# EAGLE design cradle_venus (EAGLE 9.6.2)
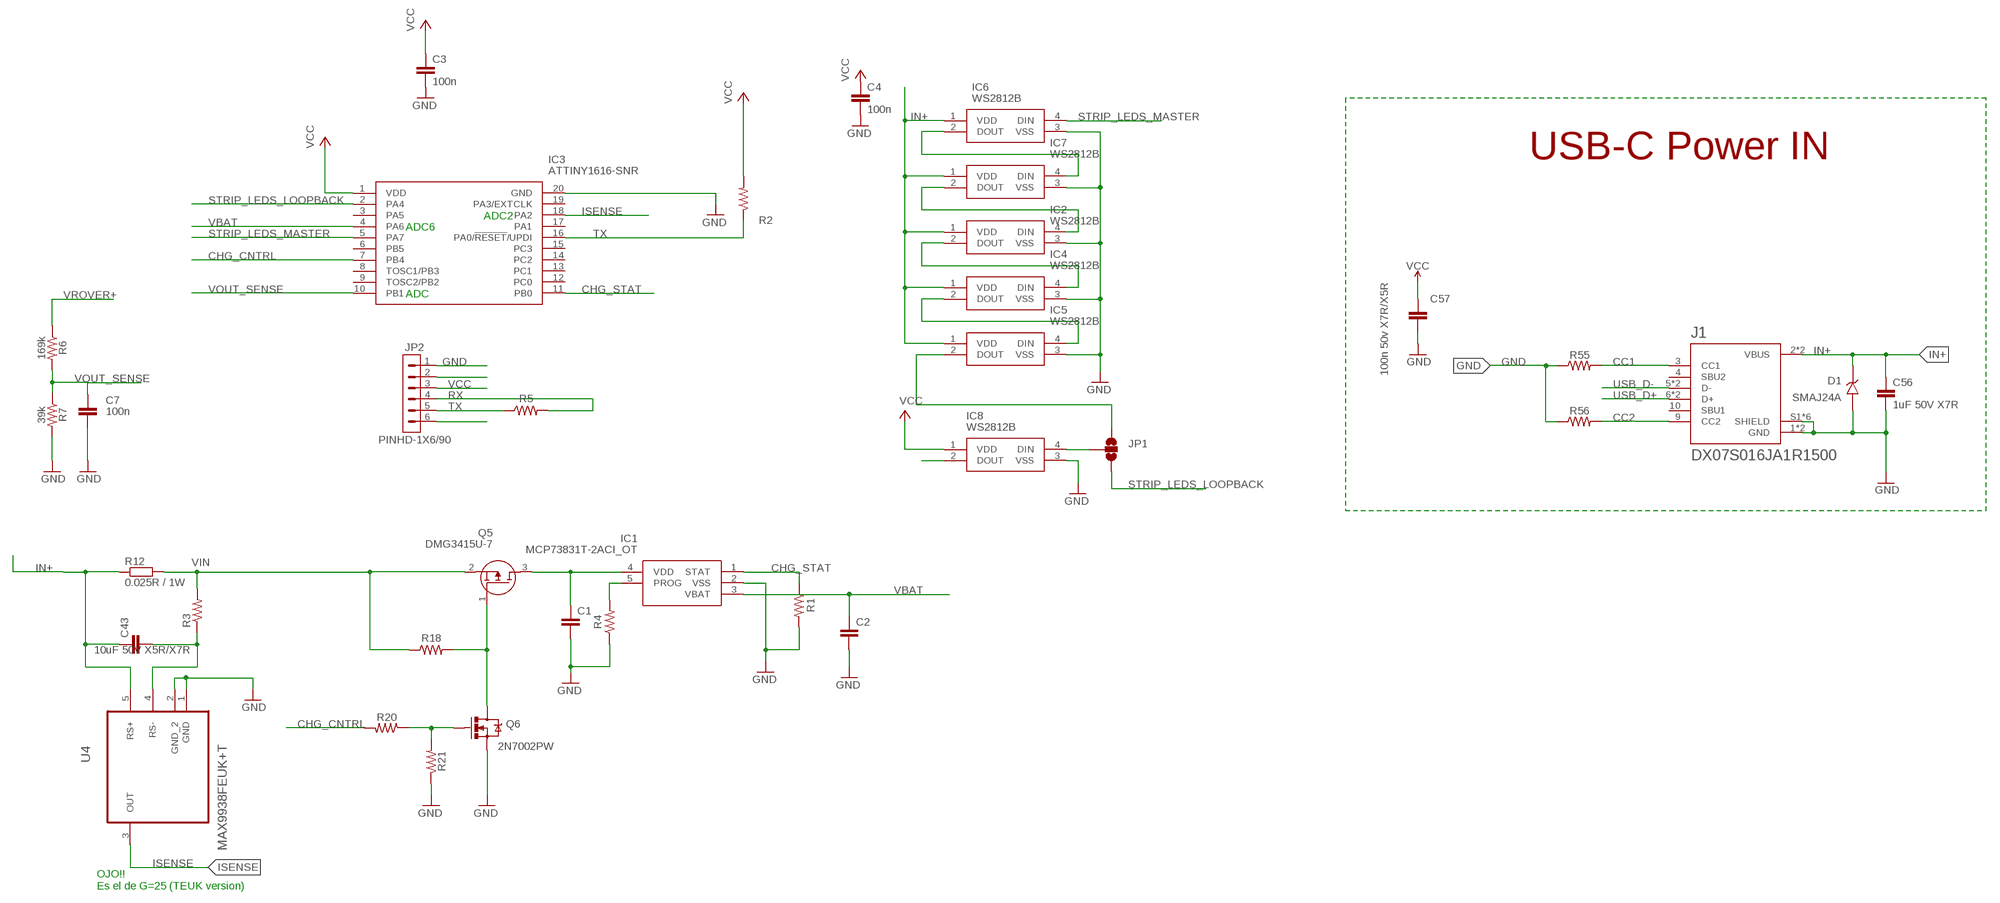
[diagram p0: schematic, sheet 1]

## Parts
C1  C-EUC0805  [C0805]
C2  C-EUC0805  [C0805]
C3  100n  C-EUC0805  [C0805]
C4  100n  C-EUC0805  [C0805]
C7  100n  0.1UF-0603-25V-(+80/-20%)  [0603]
C43  10uF 50V X5R/X7R  CAP1206  [1206]
C56  1uF 50V X7R  CAP0805  [0805]
C57  100n 50v X7R/X5R  CAP0805  [0805]
D1  SMAJ24A  3SMAJ5934B  [DIOM4325X244N]
IC1  MCP73831T-2ACI_OT  [SOT95P270X145-5N]
IC2  WS2812B  [WS2812B]
IC3  ATTINY1616-SNR  [SOIC127P1030X265-20N]
IC4  WS2812B  [WS2812B]
IC5  WS2812B  [WS2812B]
IC6  WS2812B  [WS2812B]
IC7  WS2812B  [WS2812B]
IC8  WS2812B  [WS2812B]
J1  DX07S016JA1R1500  [JAE_DX07S016JA1R1500]
JP1  JUMPER-SMT_3_NO_SILK  [SMT-JUMPER_3_NO_SILK]
JP2  PINHD-1X6/90  [1X06/90]
Q5  DMG3415U-7  SSM3J338R,LF  [SSM3J332RLFT]
Q6  2N7002PW  MOSFET-NCHANNEL2N7002PW  [SOT323]
R1  RESISTOR0805  [0805]
R2  RESISTOR0805  [0805]
R3  RESISTOR0805  [0805]
R4  RESISTOR0805  [0805]
R5  RESISTOR0805  [0805]
R6  169k  RESISTOR0603  [0603]
R7  39k  RESISTOR0603  [0603]
R12  0.025R / 1W  RR2512  [R2512]
R18  RESISTOR0805  [0805]
R20  RESISTOR0805  [0805]
R21  RESISTOR0805  [0805]
R55  RESISTOR0805  [0805]
R56  RESISTOR0805  [0805]
U4  MAX9938FEUK+T  [SOT95P280X145-5N]

## Nets
CC1: J1.3(CC1) R55.2
CC2: J1.9(CC2) R56.2
CHG_CNTRL: IC3.7(PB4) R20.2
CHG_STAT: IC1.1(STAT) IC3.11(PB0) R1.1
GND: C1.2 C2.2 C3.2 C4.2 C7.2 C56.2 C57.2 D1.A IC1.2(VSS) IC2.3(VSS) IC3.20(GND) IC4.3(VSS) IC5.3(VSS) IC6.3(VSS) IC7.3(VSS) IC8.3(VSS) J1.1(GND) J1.12(GND) J1.S1(SHIELD) J1.S2(SHIELD) J1.S3(SHIELD) J1.S4(SHIELD) J1.S5(SHIELD) J1.S6(SHIELD) JP2.1 Q6.2(S) R1.2 R4.1 R7.2 R21.1 R55.1 R56.1 U4.1(GND) U4.2(GND_2)
IN+: C3.1 C4.1 C43.1 C56.1 C57.1 D1.C(K) IC2.1(VDD) IC3.1(VDD) IC4.1(VDD) IC5.1(VDD) IC6.1(VDD) IC7.1(VDD) IC8.1(VDD) J1.2(VBUS) J1.11(VBUS) R2.2 R12.1 U4.5(RS+) ; supply symbol labelled VCC
ISENSE: IC3.18(PA2) U4.3(OUT)
N$1: C1.1 IC1.4(VDD) Q5.3(D)
N$2: IC6.2(DOUT) IC7.4(DIN)
N$4: C43.2 R3.1 U4.4(RS-)
N$5: IC2.2(DOUT) IC4.4(DIN)
N$6: IC4.2(DOUT) IC5.4(DIN)
N$7: Q6.1(G) R20.1 R21.2
N$8: IC2.4(DIN) IC7.2(DOUT)
N$9: IC8.4(DIN) JP1.2
N$10: IC5.2(DOUT) JP1.1
N$11: IC8.2(DOUT)
N$12: Q5.1(G) Q6.3(D) R18.2
N$13: JP2.2
N$14: JP2.6
N$15: IC1.5(PROG) R4.2
RX: JP2.4 R5.2
STRIP_LEDS_LOOPBACK: IC3.2(PA4) JP1.3
STRIP_LEDS_MASTER: IC3.5(PA7) IC6.4(DIN)
TX: IC3.16(PA0/!RESET!/UPDI) JP2.5 R2.1 R5.1
USB_D+: J1.6(D+) J1.7(D+)
USB_D-: J1.5(D-) J1.8(D-)
VBAT: C2.1 IC1.3(VBAT) IC3.4(PA6)
VCC: JP2.3
VIN: Q5.2(S) R3.2 R12.2 R18.1
VOUT_SENSE: C7.1 IC3.10(PB1) R6.2 R7.1
VROVER+: R6.1
Unconnected: IC3.3(PA5) IC3.6(PB5) IC3.8(TOSC1/PB3) IC3.9(TOSC2/PB2) IC3.12(PC0) IC3.13(PC1) IC3.14(PC2) IC3.15(PC3) IC3.17(PA1) IC3.19(PA3/EXTCLK) J1.4(SBU2) J1.10(SBU1)

## Notes on the sheet
- USB-C Power IN
- ADC2
- ADC6
- ADC
- OJO!!
  Es el de G=25 (TEUK version)

## Library data of the parts
C1-C4 = resistor:C-EU: CAPACITOR, European symbol
C7 = SparkFun-Capacitors:0.1UF: 0.1µF ceramic capacitors A capacitor is a passive two-terminal electrical component used to store electrical energy temporarily in an electric field.; PROD_ID: CAP-00810; VALUE: 0.1uF
C43 C56 C57 = SparkFun-Passives:CAP: Capacitor Standard 0603 ceramic capacitor, and 0.1" leaded capacitor.
D1 = 3SMAJ5934B:3SMAJ5934B: Check availability <https://pricing.snapeda.com/parts/3SMAJ5934B/Micro%20Commercial%20Components/view-part?ref=eda>; AVAILABILITY: Not in stock; DESCRIPTION: Zener Diode Single 24V 5% 19Ohm 3000mW 2-Pin SMA T/R; MF: Micro Commercial Components; MP: 3SMAJ5934B; PACKAGE: None; PRICE: None
IC1 = SamacSys_Parts:MCP73831T-2ACI_OT: Li-Ion Charge Controller 4.2V SOT23-5 Source: Datasheet <http://ww1.microchip.com/downloads/en/DeviceDoc/20001984g.pdf>; ARROW_PART_NUMBER: MCP73831T-2ACI/OT; ARROW_PRICE-STOCK: https://www.arrow.com/en/products/mcp73831t-2aciot/microchip-technology?utm_currency=USD&region=europe; DESCRIPTION: Li-Ion Charge Controller 4.2V SOT23-5; HEIGHT: 1.45mm; MANUFACTURER_NAME: Microchip; MANUFACTURER_PART_NUMBER: MCP73831T-2ACI/OT; MOUSER_PART_NUMBER: 579-MCP73831T-2ACIOT; MOUSER_PRICE-STOCK: https://www.mouser.co.uk/ProductDetail/Microchip-Technology/MCP73831T-2ACI-OT?qs=yUQqVecv4qvbBQBGbHx0Mw%3D%3D
IC2 IC4-IC8 = SamacSys_Parts:WS2812B: NeoPixel 5050 RGB LED with Integrated Driver Chip - 10 Pack Source: Datasheet <https://cdn-shop.adafruit.com/datasheets/WS2812B.pdf>; DESCRIPTION: NeoPixel 5050 RGB LED with Integrated Driver Chip - 10 Pack; HEIGHT: 1.62mm; MANUFACTURER_NAME: Adafruit; MANUFACTURER_PART_NUMBER: WS2812B
IC3 = SamacSys_Parts:ATTINY1616-SNR: 8-bit Microcontrollers - MCU 20MHZ SOIC 85C GRN Source: Datasheet <https://datasheet.datasheetarchive.com/originals/distributors/DKDS41/DSANUWW0026757.pdf>; ARROW_PART_NUMBER: ATTINY1616-SNR; ARROW_PRICE-STOCK: https://www.arrow.com/en/products/attiny1616-snr/microchip-technology?utm_currency=USD&region=nac; DESCRIPTION: 8-bit Microcontrollers - MCU 20MHZ SOIC 85C GRN; HEIGHT: 2.65mm; MANUFACTURER_NAME: Microchip; MANUFACTURER_PART_NUMBER: ATTINY1616-SNR; MOUSER_PART_NUMBER: 556-ATTINY1616SNR; MOUSER_PRICE-STOCK: https://www.mouser.co.uk/ProductDetail/Microchip-Technology/ATTINY1616-SNR?qs=HXFqYaX1Q2w711d4DTfCdw%3D%3D
J1 = DX07S016JA1R1500:DX07S016JA1R1500: USB-C (USB TYPE-C) USB 2.0 Receptacle Connector 24 (16+8 Dummy) Position Surface Mount, Right Angle; Through Hole; DESCRIPTION: USB-C (USB TYPE-C) USB 2.0 Receptacle Connector 24 (16+8 Dummy) Position Surface Mount, Right Angle; Through Hole; DIGI-KEY_PART_NUMBER: 670-DX07S016JA1R1500CT-ND; MF: JAE Electronics; MP: DX07S016JA1R1500; PACKAGE: None; PURCHASE-URL: https://pricing.snapeda.com/search/part/DX07S016JA1R1500/?ref=eda
JP1 = SparkFun-Jumpers:JUMPER-SMT_3_NO: Normally open jumper This jumper has three pads in close proximity to each other. Apply solder to close the connection(s).
JP2 = Connector:PINHD-1X6: Pin Header; CATEGORY: Connectors; DESCRIPTION: Header-Right Angle-6 Position; PACKAGE_TYPE: Through Hole; PITCH: 0.100" (2.54mm); SUBCATEGORY: Headers; TYPE: Male Pins
Q5 = SSM3J338R_LF:SSM3J338R,LF: MOSFET Small-signal MOSFET Vdss= -12V, ID= -6A Source: Datasheet <http://toshiba.semicon-storage.com/info/docget.jsp?did=30384&prodName=SSM3J338R>; ARROW_PART_NUMBER: SSM3J338R,LF; ARROW_PRICE-STOCK: https://www.arrow.com/en/products/ssm3j338rlf/toshiba?region=nac; DESCRIPTION: MOSFET Small-signal MOSFET Vdss= -12V, ID= -6A; HEIGHT: mm; MANUFACTURER_NAME: Toshiba; MANUFACTURER_PART_NUMBER: SSM3J338R,LF; MOUSER_PART_NUMBER: 757-SSM3J338RLF; MOUSER_PRICE-STOCK: https://www.mouser.co.uk/ProductDetail/Toshiba/SSM3J338RLF?qs=lhkzy8lC%252BSvURFM9ZjmJSw%3D%3D
Q6 = SparkFun-DiscreteSemi:MOSFET-NCHANNEL: Common NMOSFET Parts MFG P/N Store ID Prod ID FDD8780 TRANS-09984 SI7820DN TRANS-11055 FDS6630A IC-08089 2N7002PW TRANS-11151 FQP30N06L COM-10213 TRANS-10060 BSS123LT1G TRANS-08345 BSS138 TRANS-00830 BS170 2N7000; PROD_ID: TRANS-11151
R1-R7 R18 R20 R21 R55 R56 = SparkFun-Resistors:RESISTOR: Generic Resistor Package
R12 = eagle-ltspice:R: RESISTOR, European symbol; SPICEMODEL: NONE; SPICEPREFIX: R
U4 = MAX9938:MAX9938FEUK+T; DESCRIPTION: Precision Current-Sense Amplifier; MPN: MAX9938FEUK+T; OC_FARNELL: -; OC_NEWARK: 01N6733; PACKAGE: SOT-23-5; SUPPLIER: Maxim

## Net classes
1 highpower: width 0.254 mm, drill 0.483 mm

## Board
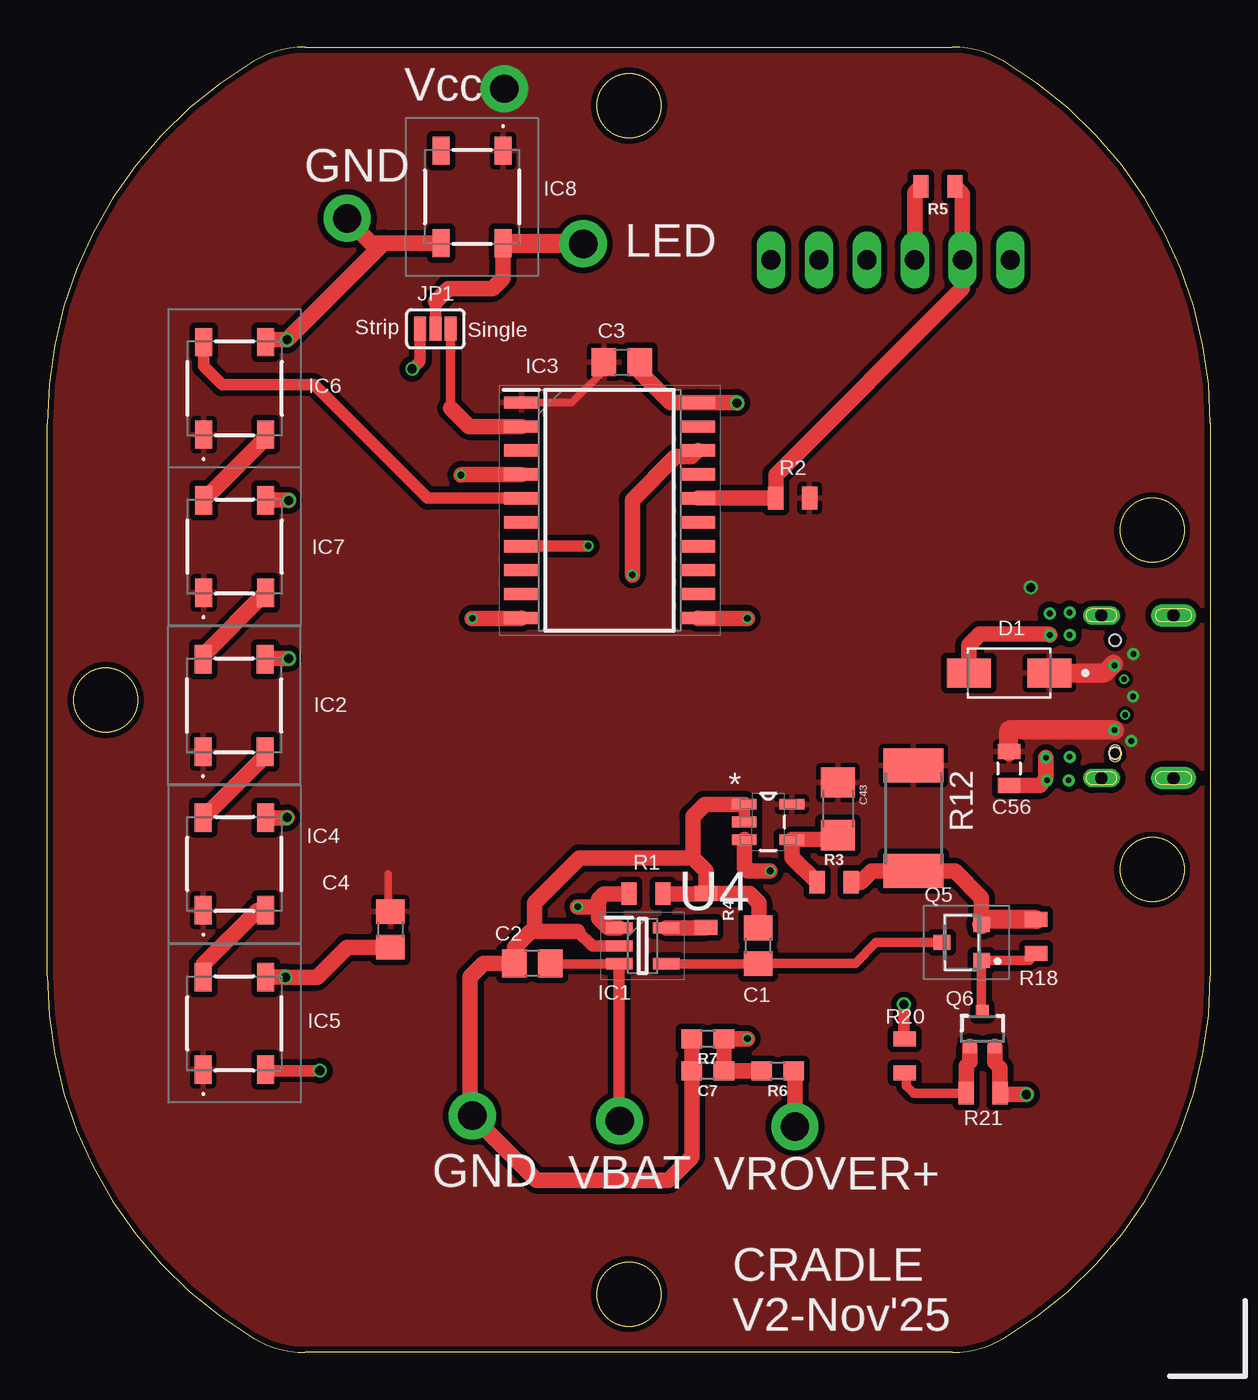
[diagram p1: board, top side]
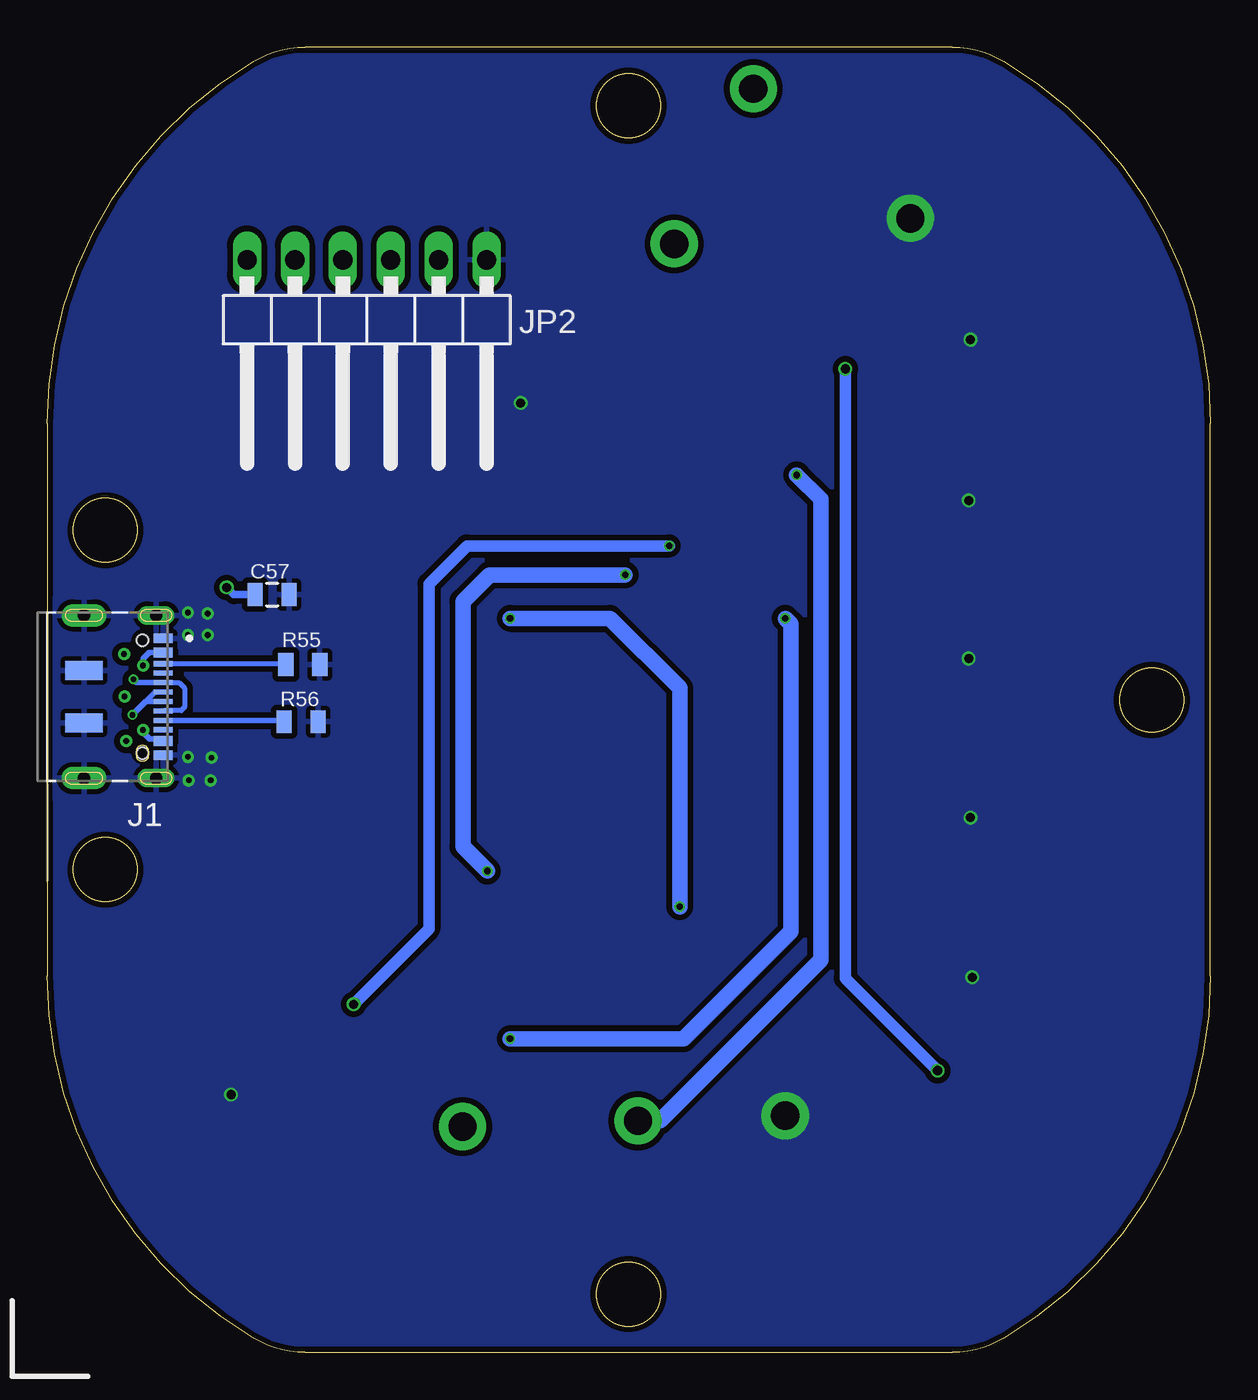
[diagram p2: board, bottom side, seen from below]

Size 61.7 x 69.23 mm. Coordinates in mm from the lower left corner, seen from the top.
Outline: 10.96,0.75 arc31 13.69,0 48.01,0 arc31 50.74,0.75 arc59 61.7,19.98 61.7,49.25 arc59 50.74,68.48 arc31 48.01,69.23 13.69,69.23 arc31 10.96,68.48 arc59 0,49.25 0,19.98 arc59 10.96,0.75
Outline: circle at 30.86,66.12 radius 1.7
Outline: circle at 58.61,43.6 radius 1.7
Outline: circle at 30.86,3.09 radius 1.7
Outline: circle at 3.11,34.6 radius 1.7
Outline: circle at 58.61,25.6 radius 1.7
Copper layers (1*16): Top 0.035mm / dielectric 1.5mm / Bottom 0.035mm
Design rules "default *": minimum track width 8mil, minimum drill 12mil, track to track 8mil, track to pad 8mil, pad to pad 8mil, via to via 8mil, smd to smd 0mil, copper to edge 10mil, drill to drill 8mil, minimum pad ring 6mil, minimum via ring 4mil, stop-mask expansion 4mil, vias tented up to drill 0mil, thermal gap 10mil

### Footprints (pad centres in the part's own frame; a part is rotated, then mirrored left to right if it is on the bottom)
C0805 = smd 1.3 x 1.5: 1 -0.95,0; 2 0.95,0
0603 = smd 1.1 x 1: 1 -0.85,0; 2 0.85,0
1206 = smd 1.6 x 1.8: 1 -1.4,0; 2 1.4,0
0805 = smd 0.8 x 1.2: 1 -0.9,0; 2 0.9,0
DIOM4325X244N = smd 2.33 x 1.55: A 2.135,0; C -2.135,0
SOT95P270X145-5N = smd 1.4 x 0.6: 1 -1.25,0.95; 2 -1.25,0; 3 -1.25,-0.95; 4 1.25,-0.95; 5 1.25,0.95
WS2812B = smd 1.5 x 0.9: 1 -2.45,1.65; 2 -2.45,-1.65; 3 2.45,-1.65; 4 2.45,1.65
SOIC127P1030X265-20N = smd 1.85 x 0.65: 1 -4.675,5.715; 2 -4.675,4.445; 3 -4.675,3.175; 4 -4.675,1.905; 5 -4.675,0.635; 6 -4.675,-0.635; 7 -4.675,-1.905; 8 -4.675,-3.175; 9 -4.675,-4.445; 10 -4.675,-5.715; 11 4.675,-5.715; 12 4.675,-4.445; 13 4.675,-3.175; 14 4.675,-1.905; 15 4.675,-0.635; 16 4.675,0.635; 17 4.675,1.905; 18 4.675,3.175; 19 4.675,4.445; 20 4.675,5.715
JAE_DX07S016JA1R1500 = smd 0.52 x 1: 1 -3.1,1.1; 2 -2.35,1.1; 11 2.35,1.1; 12 3.1,1.1 | smd 0.27 x 1: 3 -1.75,1.1; 4 -1.25,1.1; 5 -0.75,1.1; 6 -0.25,1.1; 7 0.25,1.1; 8 0.75,1.1; 9 1.25,1.1; 10 1.75,1.1 | smd 1 x 2: S1 -1.4,-3.1; S2 1.4,-3.1 | drill 0.65 long: S3 -4.32,0.725; S4 4.32,0.725 | drill 0.65 pad 1.2 long: S5 -4.32,-3.1; S6 4.32,-3.1 | hole 0.6: 3,0 | hole 0.63: 3,0; -3,0
SMT-JUMPER_3_NO_SILK = smd 0.635 x 1.27: 1 -0.813,0; 2 0,0; 3 0.813,0
1X06/90 = drill 1.016 long: 1 -6.35,-3.81; 2 -3.81,-3.81; 3 -1.27,-3.81; 4 1.27,-3.81; 5 3.81,-3.81; 6 6.35,-3.81
SSM3J332RLFT = smd 0.8 x 0.9: 1 -0.95,-1.05; 2 0.95,-1.05; 3 0,1.05
SOT323 = smd 0.7 x 0.7: 1 -0.65,-0.925; 2 0.65,-0.925; 3 0,0.925
R2512 = smd 1.8 x 3.2: 1 -2.8,0; 2 2.8,0
SOT95P280X145-5N = smd 1.321 x 0.559: 1 -1.27,0.94; 2 -1.27,0; 3 -1.27,-0.94; 4 1.27,-0.94; 5 1.27,0.94

### Placement (x,y rotation side)
C1  37.71,21.56 90 top
C2  25.73,20.63 180 top
C3  30.47,52.52 0 top
C4  18.2,22.43 270 top
C7  35.05,14.93 180 top
C43  41.94,28.83 270 top
C56  51.02,30.96 270 top
C57  49.77,40.19 0 bottom
D1  51.02,36.03 180 top
IC1  31.58,21.56 0 top
IC2  9.91,34.31 90 top
IC3  29.83,44.66 0 top
IC4  9.94,25.9 90 top
IC5  9.94,17.45 90 top
IC6  9.94,51.13 90 top
IC7  9.94,42.74 90 top
IC8  22.53,61.28 270 top
J1  56.64,34.77 270 bottom
JP1  20.59,54.29 0 top
JP2  44.74,54.13 180 bottom
Q5  48.52,21.74 90 top
Q6  49.6,17.15 0 top
R1  31.75,24.32 0 top
R2  39.55,45.31 0 top
R3  41.74,24.93 0 top
R4  34.94,23.43 270 top
R5  47.24,61.83 180 top
R6  38.74,14.93 180 top
R7  35.05,16.63 180 top
R12  45.94,28.33 270 top
R18  52.45,22.05 270 top
R20  45.47,15.73 90 top
R21  49.64,13.74 180 top
R55  48.13,36.48 180 bottom
R56  48.23,33.45 180 bottom
U4  38.24,28.13 0 top

### Tracks (layer width: path | path; a pad name or v marks a point on that pad's centre or on a via)
CC1
  Bottom 0.254: J1.3 49.08,36.52
  Bottom 0.305: 49.08,36.52 R55.2
CC2
  Bottom 0.305: J1.9 49.2,33.52 R56.2
CHG_CNTRL  (via drill 0.35, 0.48)
  Top 0.61: v28.69,42.77 28.68,42.76 IC3.7 | v45.44,18.46 45.44,16.66 R20.2
  Bottom 0.61: v45.44,18.46 41.44,22.46 41.44,40.76 39.44,42.77 v28.69,42.77
CHG_STAT  (via drill 0.35)
  Top 0.813: IC1.1 29.77,22.51 29.24,23.03 29.24,23.53 | 29.24,23.53 29.24,24.03 29.53,24.32 R1.1 | 29.24,23.53 29.14,23.63 v28.14,23.63 | v37.14,38.93 34.52,38.93 IC3.11
  Bottom 0.813: v37.14,38.93 31.84,38.93 28.14,35.23 v28.14,23.63
GND  (via drill 0.3 pad 0.64, 0.48, 1.5 pad 2.5)
  Top 0.61: IC1.2 28.91,21.56 28.14,22.33 | U4.2 U4.1
  Top 0.813: D1.A 48.88,37.51 49.46,38.09 53.13,38.09 v53.18,38.04 | C56.2 52.64,30.06 52.98,30.4 v52.98,31.54 | Q6.2 50.25,15.38 50.55,15.09 R21.1 50.61,13.67 v51.94,13.67 | v36.58,50.35 36.56,50.38 IC3.20 33.07,50.38 31.42,52.02 C3.2 | IC6.3 11.72,53.71 v12.72,53.71 17.84,58.83 IC8.3 17.19,58.83 15.91,60.11 v15.91,60.15 | IC7.3 v12.8,45.19 v12.81,45.18 | IC2.3 11.6,36.8 v12.81,36.8 | IC4.3 v12.71,28.35 v12.72,28.36 | IC5.3 v12.62,19.9 v12.63,19.89 14.31,19.89 15.91,21.48 C4.2 | 28.14,22.33 25.84,22.33 | 25.84,22.33 25.64,22.33 24.78,21.47 C2.2 23.14,20.63 22.42,19.91 22.42,12.68 v22.55,12.55 25.97,9.13 32.94,9.13 34.19,10.38 C7.2 R7.2 | R1.2 R4.1 | R4.1 37.24,24.33 37.74,23.83 37.74,22.54 C1.2 | 25.84,22.33 25.84,23.83 28.24,26.23 34.24,26.23 | R4.1 34.94,25.53 34.24,26.23 | U4.1 34.88,29.07 34.24,28.43 34.24,26.23
  other vias: 54.23,31.59 54.18,30.34 53.03,30.34 54.23,39.24 54.23,38.04 53.18,39.19
  pour Bottom (isolate 0.254): 52.64,37.38 52.64,39.98 61.61,39.98 61.61,29.38 61.58,29.35 52.74,29.35 52.66,29.43 52.66,32.18 54.96,32.18 54.96,31.63 59.06,31.63 59.06,37.48 58.71,37.83 56.52,37.83 56.06,37.38
  pour Bottom (isolate 0.305): -0.86,-1.27 63.45,-1.27 63.45,70.73 -0.86,70.73
IN+  (via drill 0.3 pad 0.64, 0.48, 1.5 pad 2.5)
  Top 0.406: C3.1 29.52,52.08 27.82,50.38 IC3.1 | C4.1 18.09,23.49 18.09,25.37
  Top 1.016: D1.C 56.09,36.03 56.55,36.49 | C56.1 51.02,33.01 v56.61,33.01
  Bottom 0.305: v56.61,36.43 56.61,36.8 56.3,37.12 J1.2 | v56.61,33.01 56.58,32.98 56.58,32.85 56.25,32.52 55.64,32.52 J1.11
  Bottom 0.406: C57.1 51.8,40.19 v52.17,40.57
  other vias: 57.51,32.42 57.62,37.04 57.6,34.78 24.24,67.03
  pour Top: 55.53,31.72 55.53,37.74 58.3,37.74 58.3,31.72
  pour Top (isolate 0.305, rank 2): -0.86,-1.47 63.45,-1.47 63.45,70.73 -0.86,70.73
ISENSE  (via drill 0.35)
  Top 0.813: IC3.18 34.17,47.5 33.33,47.5 31.05,45.21 v31.05,41.23 | v38.34,25.53 37.14,25.53 36.97,25.7 U4.3
  Bottom 0.813: v31.05,41.23 38.24,41.23 39.64,39.83 39.64,26.83 v38.34,25.53
N$1
  Top 0.508: Q5.3 43.96,21.74 42.86,20.64 37.74,20.64 C1.1 IC1.4
N$2
  Top 0.813: IC7.4 11.59,48.49 IC6.2
N$4
  Top 0.813: C43.2 41.7,27.19 U4.4 39.52,26.26 R3.1
N$5
  Top 0.813: IC4.4 11.56,31.63 IC2.2
N$6
  Top 0.813: IC5.4 8.28,20.58 11.16,23.45 IC4.2
N$7
  Top 0.508: R20.1 45.58,14.72 45.58,14.13 45.97,13.74 R21.2 | 48.95,15.4 48.74,15.19
  Top 0.813: R21.2 48.74,15.19 | 48.95,15.4 Q6.1
N$8
  Top 0.813: IC2.4 8.27,36.96 IC7.2
N$9  (via drill 1.5 pad 2.5)
  Top 0.61: JP1.2 20.59,55.73
  Top 0.813: IC8.4 24.19,56.98 23.62,56.42 21.28,56.42 20.59,55.73
  Top 1.016: IC8.4 28.4,58.83 v28.44,58.8
N$10  (via drill 0.48)
  Top 0.61: JP1.1 19.78,52.58 v19.36,52.16 | v14.46,14.94 11.64,14.94 IC5.2
  Bottom 0.61: v19.36,52.16 19.36,19.84 v14.46,14.94
N$12
  Top 0.508: Q6.3 49.56,18.12 Q5.1 52.09,20.79 R18.2
N$15
  Top 0.813: IC1.5 34.92,22.51 R4.2
RX
  Top 0.813: R5.2 46.02,61.5 JP2.4
STRIP_LEDS_LOOPBACK
  Top 0.508: JP1.3 21.41,50.08
  Top 0.813: IC3.2 22.38,49.11 21.41,50.08
STRIP_LEDS_MASTER
  Top 0.61: IC3.5 20.18,45.3 14.16,51.32 9.27,51.32 8.3,52.3 IC6.4
TX
  Top 0.813: IC3.16 38.63,45.3 R2.1 38.64,46.53 48.55,56.44 JP2.5 48.55,61.42 R5.1
USB_D+  (via drill 0.3)
  Bottom 0.254: J1.6 55.97,35.02 56.5,34.49
  Bottom 0.305: J1.7 56.47,34.52 56.5,34.49 v57.18,33.81
USB_D-  (via drill 0.3)
  Bottom 0.254: J1.5 54.71,35.53 54.4,35.22 54.4,34.22 54.59,34.04 55.53,34.04 J1.8
  Bottom 0.305: J1.5 56.95,35.52 v57.12,35.7
VBAT  (via drill 0.35, 1.5 pad 2.5)
  Top 0.508: IC1.3 26.7,20.61 C2.1
  Top 0.61: IC1.3 30.33,12.31
  Top 0.813: v21.94,46.53 21.98,46.57 IC3.4
  Top 1.016: v30.36,12.28 30.33,12.31
  Bottom 0.813: v30.36,12.28 29.2,12.28 20.66,20.82 20.66,45.25 v21.94,46.53
VIN
  Top 0.813: R3.2 43.14,24.93 43.74,25.53 R12.2 48.14,25.53 49.56,24.11 Q5.2
  Top 1.016: R18.1 49.83,22.95 Q5.2
VOUT_SENSE  (via drill 0.35)
  Top 0.813: R6.2 C7.1 R7.1 v37.14,16.63 | IC3.10 25.14,38.93 v22.55,38.93
  Bottom 0.813: v22.55,38.93 22.24,38.63 22.24,22.33 27.94,16.63 v37.14,16.63
VROVER+  (via drill 1.5 pad 2.5)
  Top 0.813: R6.1 39.66,14.86 v39.66,11.98

### Text on the board
tPlace: Vcc | GND | LED | Strip | Single | GND | VBAT | VROVER+ | CRADLE / V2-Nov'25